# EAGLE design BOSS_FA-1 (EAGLE 7.4.0)
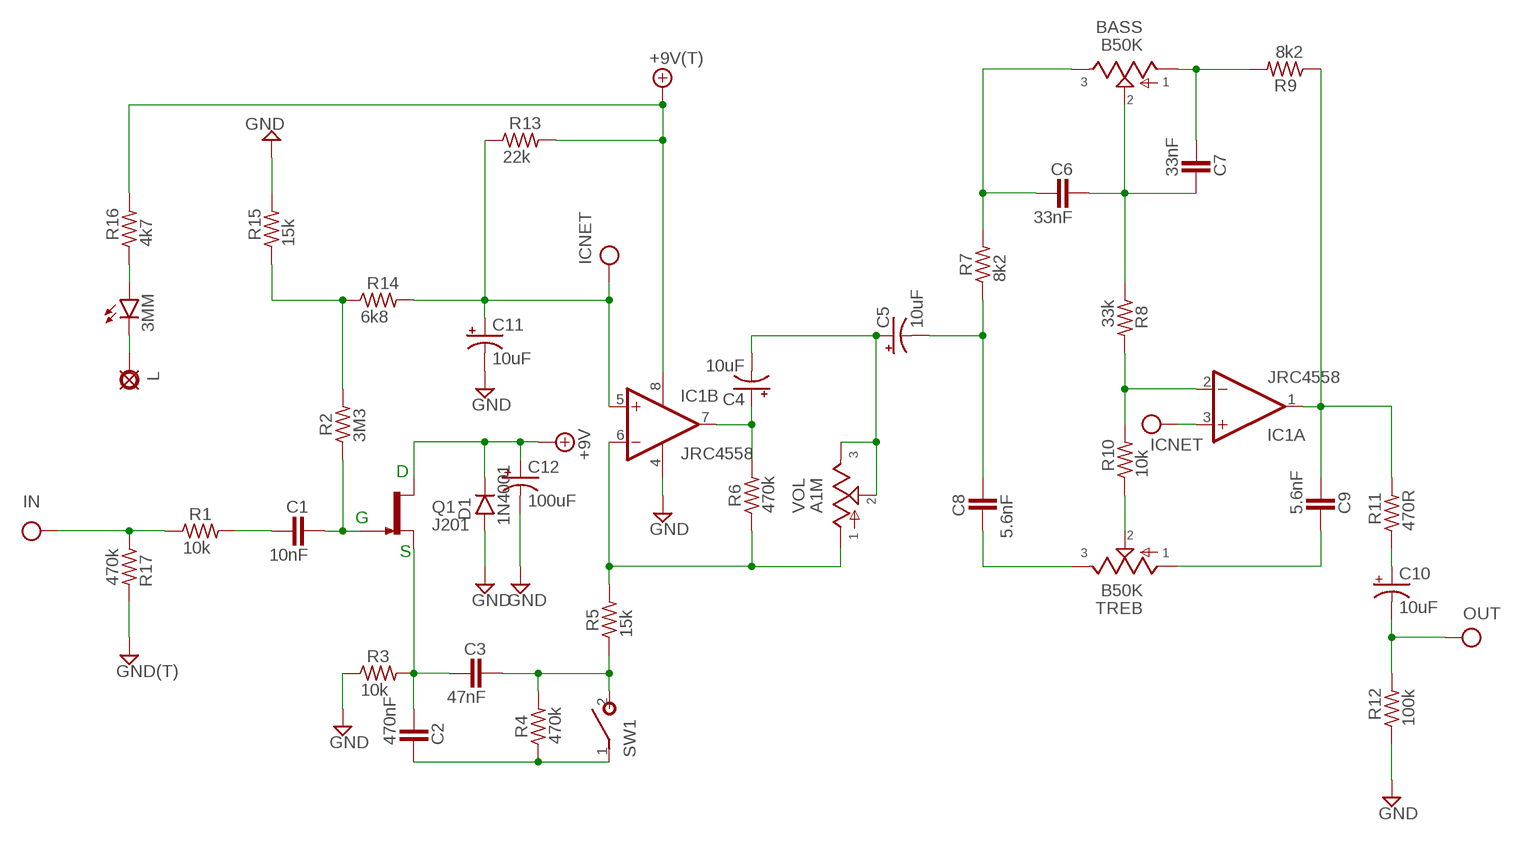
[diagram p0: schematic, sheet 1]

## Parts
3MM  LED3MM  [LED3MM]
+9V  +9V(T)  [SQUARE]
BASS  B50K  POT16MM_PCB_PADS  [16MM_PCB_PADS]
C1  10nF  072X0252  [072X025]
C2  470nF  072X0352  [072X035]
C3  47nF  072X0252  [072X025]
C4  10uF  0501  [050_020_1]
C5  10uF  0501  [050_020_1]
C6  33nF  072X0252  [072X025]
C7  33nF  072X0252  [072X025]
C8  5.6nF  072X0252  [072X025]
C9  5.6nF  072X0252  [072X025]
C10  10uF  0501  [050_020_1]
C11  10uF  0501  [050_020_1]
C12  100uF  0631  [063_025]
D1  1N4001  1N400X.3  [DO41-3]
G  GND(T)  [SQUARE]
IC1  JRC4558  LM4558N  [DIL08]
IN  IN(T)  [SQUARE]
L  PAD  [SQUARE]
OUT  OUT(T)  [SQUARE]
Q1  J201  [TO92-]
R1  10k  6MM.3  [R0207/3]
R2  3M3  6MM.3  [R0207/3]
R3  10k  6MM.3  [R0207/3]
R4  470k  6MM.3  [R0207/3]
R5  15k  6MM.3  [R0207/3]
R6  470k  6MM.3  [R0207/3]
R7  8k2  6MM.3  [R0207/3]
R8  33k  6MM.3  [R0207/3]
R9  8k2  6MM.3  [R0207/3]
R10  10k  6MM.3  [R0207/3]
R11  470R  6MM.3  [R0207/3]
R12  100k  6MM.3  [R0207/3]
R13  22k  6MM.3  [R0207/3]
R14  6k8  6MM.3  [R0207/3]
R15  15k  6MM.3  [R0207/3]
R16  4k7  6MM.3  [R0207/3]
R17  470k  6MM.3  [R0207/3]
SW1  SPST  [SPST]
TREB  B50K  POT16MM_PCB_PADS  [16MM_PCB_PADS]
VOL  A1M  POT16MM_PCB_PADS  [16MM_PCB_PADS]

## Nets
+9V: +9V.1(+9V) C12.+ D1.C IC1.8(P:V+) Q1.3(D) R13.2 R16.2
A: C11.+ IC1.3(A:+IN) IC1.5(B:+IN) R13.1 R14.2 ; supply symbol labelled ICNET
GND: C11.- C12.- D1.A G.1(GND) IC1.4(P:V-) R3.1 R12.1 R15.2 R17.2
IN: IN.1(IN) R1.1 R17.1
N$1: C1.1 R1.2
N$2: C1.2 Q1.1(G) R2.1
N$3: 3MM.A R16.1
N$4: R10.1 TREB.2
N$5: C3.2 R4.2 R5.1 SW1.2(S)
N$6: C4.+ IC1.7(B:OUT) R6.2
N$7: IC1.6(B:-IN) R5.2 R6.1 VOL.1
N$8: 3MM.K(C) L.1(PAD)
N$9: C2.2 R4.1 SW1.1(P)
N$10: C2.1 C3.1 Q1.2(S) R3.2
N$11: C4.- C5.+ VOL.2 VOL.3
N$12: C5.- C8.2 R7.1
N$13: BASS.3 C6.1 R7.2
N$14: BASS.2 C6.2 C7.2 R8.1
N$15: BASS.1 C7.1 R9.2
N$16: C9.1 IC1.1(A:OUT) R9.1 R11.2
N$17: IC1.2(A:-IN) R8.2 R10.2
N$18: C9.2 TREB.1
N$19: C8.1 TREB.3
N$20: C10.+ R11.1
N$21: R2.2 R14.1 R15.1
OUT: C10.- OUT.1(OUT) R12.2

## Notes on the sheet
- D
- G
- S

## Library data of the parts
3MM = mb_diodes:LED
+9V = mb_supply:+9V(T): +9V Voltage Supply use this to hook up +9v throughout a schematic instead of running wire automatically labels the net "+9v" adds a hookup pad to the circuit board
BASS TREB VOL = mb_pots:POT: Potentiometers the arrow indicates the clockwise motion of th wiper (lug 2) fully counter clockwise there is no resistance between lugs 1 and 2 fully clockwise the resistance between lugs 1 and 2 is the value of the pot
C1 C3 C6-C9 = mb_caps-box:072X025: 1000pF - 0.47uF WIMA MKP2 63, 100V: 1000pF - 0.015uF; MKS2 50V: 0.33 - 0.47uF; 63V: 1000pF - 0.22uF;
C2 = mb_caps-box:072X035: 0.15 - 1.0uF; WIMA MKP2 63, 100V: 0.047uF; MKS2 50V: 0.68 - 1.0uF; 63V: 0.33 - 0.47uF; 100V: 0.15 - 0.22uF;
C4 C5 C10 C11 = mb_caps-electro:050: 0.22 - 100uF Xicon values at Mouser.com: 10V: 10 - 100uF; 16V: 2.2 - 47uF; 25V: 0.47 - 47uF; 50V: 0.22 - 22uF
C12 = mb_caps-electro:063: 33 - 220uF Xicon values at Mouser.com 10V: 220uF; 16V: 100uF; 25V: 100uF; 50V: 33uF
D1 = mb_diodes:1N400X: Rectifier Diodes often used in power supply to prevent damage from reverse polarization
G = mb_supply:GND(T): Ground use this to hook up ground (GND) throughout a schematic instead of running wire automatically labels the net "GND" adds a hookup pad to the circuit board (you can use several)
IC1 = mb_ics:*4558: *4558 Op Amp Infamous for its use in tube screamers. This op amp has many manufacturers, hence the leading "*" in the name. The JRC4558 is a widely used example.
IN = mb_supply:IN(T): Input obsolete: use Pad instead and label net shematic input label with circuit board terminal/pad generally used only once on a schematic (because this device labels the net "IN" in the same way as a voltage supply or ground net)
L = mb_supply:PAD: PAD use this package for pads with any purpose, including input, output, send or return various pad shapes: round, square, octogonal, long, and long offset
OUT = mb_supply:OUT(T): Output obsolete: use Pad instead and label net output label with circuit board terminal/pad usually appears only once on a schematic
Q1 = mb_trans:J201: N-channel JFET
R1-R17 = mb_resistors:6MM: 6mm Resistors Leads spaced 1-6 holes apart for 0.1" perfboard. Suitable for 1/4 watt resistors.
SW1 = mb_switches:SPST

## Board
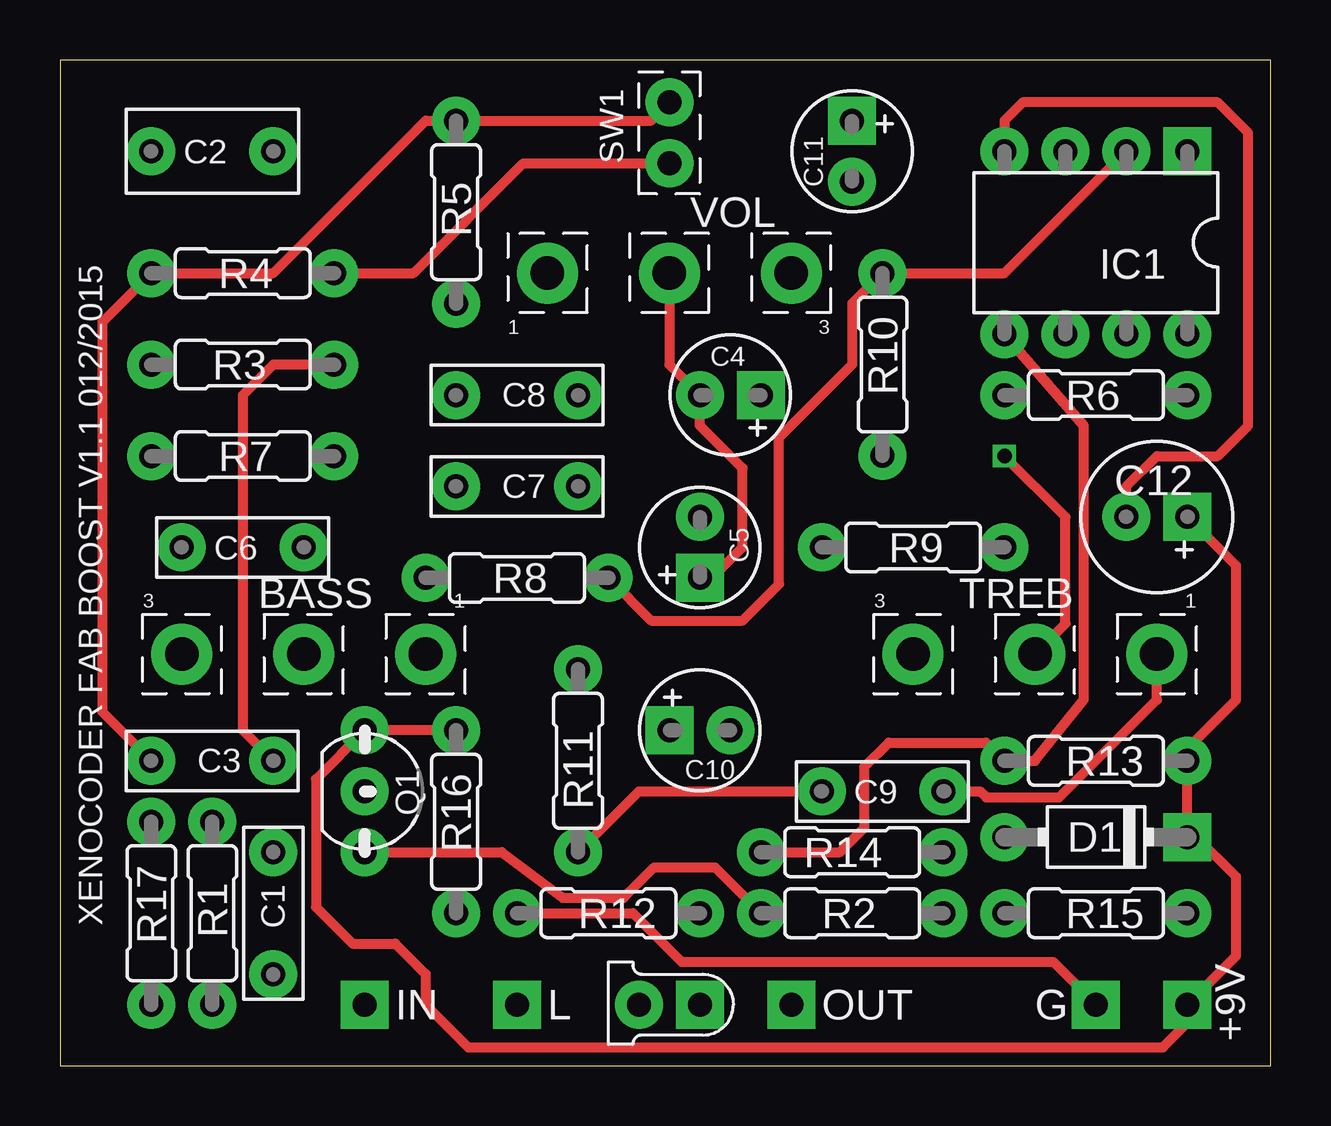
[diagram p1: board, top side]
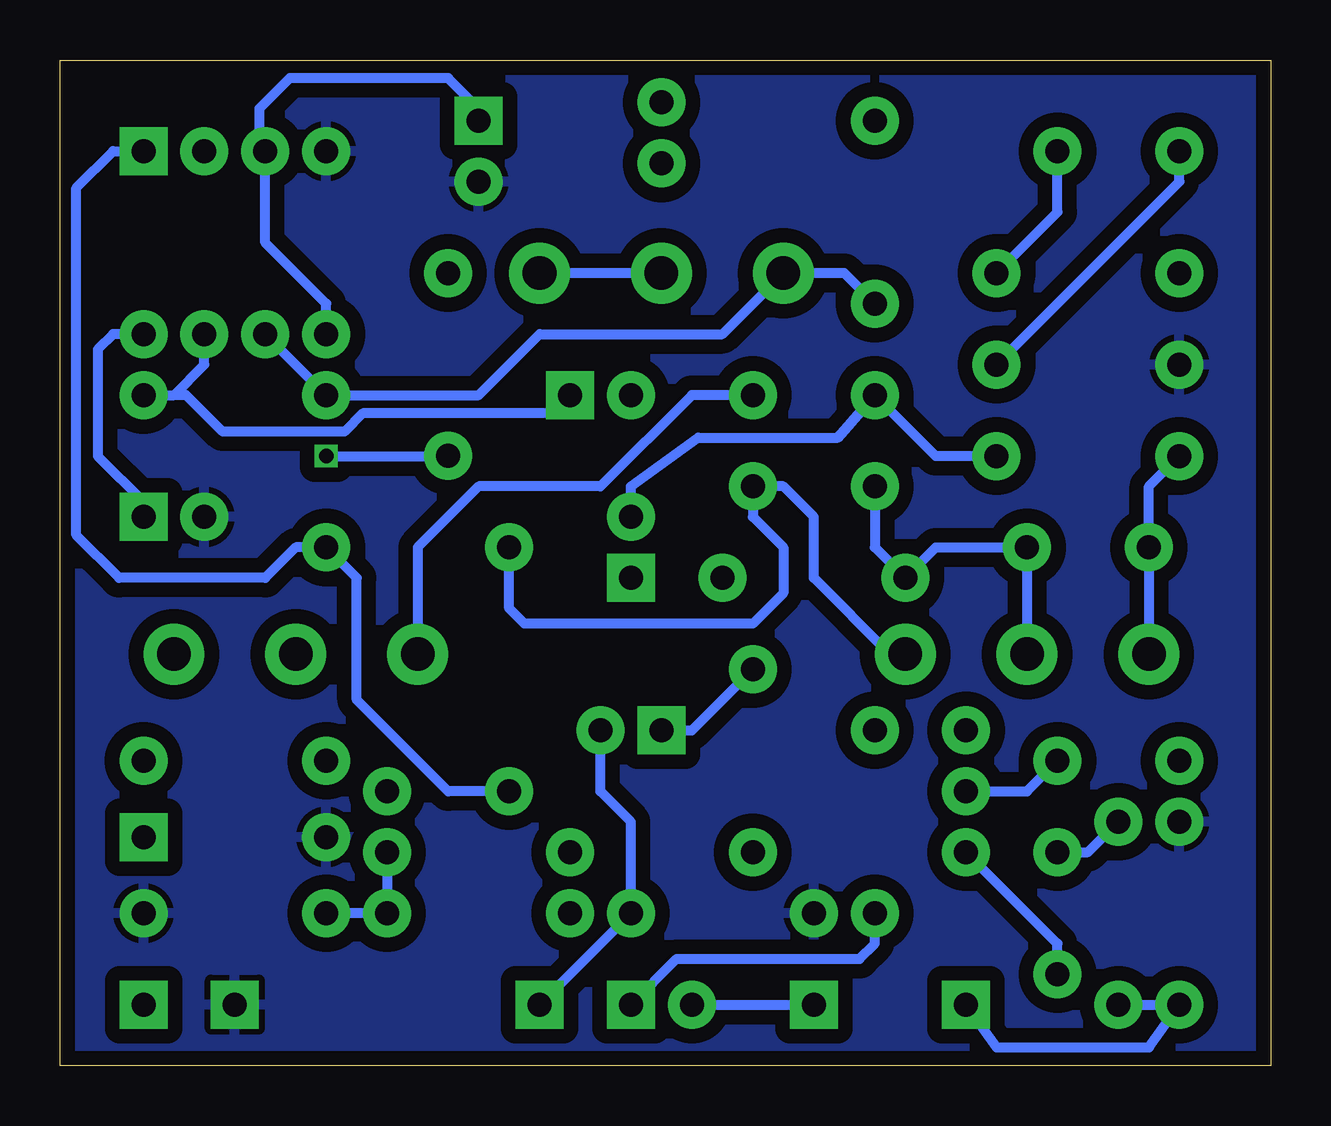
[diagram p2: board, bottom side, seen from below]

Size 50.47 x 41.9 mm. Coordinates in mm from the lower left corner, seen from the top.
Outline: 0,0 50.47,0 50.47,41.9 0,41.9 0,0
Copper layers (1*16): Top 0.0356mm / dielectric 1.5011mm / Bottom 0.0356mm
Design rules "LaenPCBOrder": minimum track width 6mil, minimum drill 13mil, track to track 6mil, track to pad 6mil, pad to pad 6mil, via to via 6mil, smd to smd 6mil, copper to edge 15mil, drill to drill 6mil, minimum pad ring 7mil, minimum via ring 7mil, stop-mask expansion 3mil, vias tented up to drill 0mil, thermal gap 10mil

### Footprints (pad centres in the part's own frame; a part is rotated, then mirrored left to right if it is on the bottom)
LED3MM = drill 1 pad 2 square: A -1.27,0 | drill 1 pad 2: K 1.27,0
SQUARE = drill 1 pad 2 square: 1 0,0
16MM_PCB_PADS = drill 1.4 pad 2.54: 1 5.08,0; 2 0,0; 3 -5.08,0
072X025 = drill 1 pad 2: 1 -2.54,0; 2 2.54,0
072X035 = drill 1 pad 2: 1 -2.54,0; 2 2.54,0
050_020_1 = drill 1 pad 2 square: + -1.27,0 | drill 1 pad 2: - 1.27,0
063_025 = drill 1 pad 2 square: + -1.27,0 | drill 1 pad 2: - 1.27,0
DO41-3 = drill 1 pad 2: A 3.81,0 | drill 1 pad 2 square: C -3.81,0
DIL08 = drill 1 pad 2 square: 1 -3.81,-3.81 | drill 1 pad 2: 2 -1.27,-3.81; 3 1.27,-3.81; 4 3.81,-3.81; 5 3.81,3.81; 6 1.27,3.81; 7 -1.27,3.81; 8 -3.81,3.81
TO92- = drill 1 pad 2: 1 2.54,0; 2 0,0; 3 -2.54,0
R0207/3 = drill 1 pad 2: 1 -3.81,0; 2 3.81,0
SPST = drill 1 pad 2: 1 -1.27,0; 2 1.27,0

### Placement (x,y rotation side)
3MM  25.4,2.54 180 top
+9V  46.99,2.54 0 top
BASS  10.16,17.14 0 top
C1  8.89,6.35 270 top
C2  6.35,38.1 0 top
C3  6.35,12.7 180 top
C4  27.94,27.94 180 top
C5  26.67,21.59 90 top
C6  7.62,21.59 0 top
C7  19.05,24.13 180 top
C8  19.05,27.94 180 top
C9  34.29,11.43 0 top
C10  26.67,13.97 0 top
C11  33.02,38.1 270 top
C12  45.72,22.86 180 top
D1  43.18,9.53 180 top
G  43.18,2.54 0 top
IC1  43.18,34.29 180 top
IN  12.7,2.54 0 top
L  19.05,2.54 0 top
OUT  30.48,2.54 0 top
Q1  12.7,11.43 270 top
R1  6.35,6.35 90 top
R2  33.02,6.35 0 top
R3  7.62,29.21 0 top
R4  7.62,33.02 180 top
R5  16.51,35.56 270 top
R6  43.18,27.94 0 top
R7  7.62,25.4 180 top
R8  19.05,20.32 0 top
R9  35.56,21.59 180 top
R10  34.29,29.21 90 top
R11  21.59,12.7 270 top
R12  22.86,6.35 0 top
R13  43.18,12.7 0 top
R14  33.02,8.89 180 top
R15  43.18,6.35 0 top
R16  16.51,10.16 90 top
R17  3.81,6.35 90 top
SW1  25.4,38.86 90 top
TREB  40.64,17.14 0 top
VOL  25.4,33.02 180 top

### Tracks (layer width: path | path; a pad name or v marks a point on that pad's centre or on a via)
+9V
  Top 0.406: C12.+ 49.02,20.83 49.02,15.24 46.99,13.21 R13.2 D1.C 47.37,9.53 49.02,7.87 49.02,4.57 +9V.1 46.99,1.78 45.97,0.76 17.02,0.76 15.24,2.54 15.24,3.81 13.97,5.08 12.19,5.08 10.67,6.6 10.67,11.94 Q1.3 R16.2
  Bottom 0.406: IC1.8 48.26,30.48 48.9,29.84 48.9,25.4 46.99,23.5 C12.+
A
  Top 0.406: IC1.5 42.67,26.67 42.67,15.24 40.64,12.7 R13.1 38.61,13.46 34.54,13.46 33.53,12.45 33.53,9.91 32.51,8.89 R14.2
  Bottom 0.406: C11.+ 33.02,39.88 34.29,41.15 40.89,41.15 42.16,39.88 42.16,38.35 IC1.3 41.91,34.29 39.37,31.75 IC1.5
GND
  Top 0.406: R12.1 23.88,6.35 25.91,4.32 41.4,4.32 G.1 | C12.- 44.45,24.13 45.72,25.4 48.26,25.4 49.53,26.67 49.53,38.86 48.26,40.13 40.13,40.13 39.37,39.37 IC1.4
  pour Bottom (isolate 0.61): 0,41.91 50.8,41.91 50.8,0 0,0
IN
  Bottom 0.406: IN.1 11.43,0.76 5.08,0.76 R17.1 R1.1
N$1
  Bottom 0.406: C1.1 7.62,8.89 R1.2
N$2
  Top 0.406: Q1.1 18.41,8.89 20.95,6.99 23.5,6.99 24.77,8.26 27.3,8.26 R2.1
  Bottom 0.406: C1.2 8.89,5.08 Q1.1
N$3
  Bottom 0.406: 3MM.A 24.77,4.45 17.14,4.45 16.51,5.08 R16.1
N$4  (via drill 0.6)
  Top 0.406: TREB.2 41.91,18.41 41.91,22.86 v39.37,25.4
  Bottom 0.406: v39.37,25.4 R10.1
N$5
  Top 0.406: C3.2 1.78,14.73 1.78,30.99 R4.2 8.89,33.02 15.24,39.37 R5.1 24.64,39.37 SW1.2
N$6
  Bottom 0.406: R6.2 45.72,27.94 | 45.72,27.94 44.45,29.21 IC1.7 | C4.+ 29.97,27.18 37.85,27.18 38.61,26.42 43.69,26.42 45.21,27.94 45.72,27.94
N$7
  Bottom 0.406: IC1.6 R6.1 33.02,27.94 30.48,30.48 22.86,30.48 VOL.1 17.78,33.02 R5.2
N$8
  Bottom 0.406: 3MM.K L.1
N$9
  Top 0.406: R4.1 14.73,33.02 19.3,37.59 SW1.1
  Bottom 0.406: R4.1 8.89,35.56 C2.2
N$10
  Top 0.406: R3.2 8.89,29.21 7.62,27.94 7.62,13.97 C3.1
  Bottom 0.406: R3.2 3.81,36.83 C2.1 | Q1.2 10.16,11.43 C3.1
N$11
  Top 0.406: VOL.2 25.4,29.21 C4.- 26.67,26.67 28.45,24.89 28.45,21.59 27.18,20.32 C5.+
  Bottom 0.406: VOL.2 VOL.3
N$12
  Bottom 0.406: R7.1 13.97,25.4 C8.2 18.03,26.16 23.88,26.16 26.67,24.13 C5.-
N$13
  Bottom 0.406: BASS.3 C6.1 5.08,24.13 R7.2
N$14
  Bottom 0.406: BASS.2 C6.2 13.97,21.59 R8.1 16.51,21.59 C7.2
N$15
  Bottom 0.406: BASS.1 15.88,17.14 19.05,20.32 19.05,22.86 20.32,24.13 C7.1 21.59,22.86 20.32,21.59 20.32,19.68 21.59,18.41 31.11,18.41 31.75,19.05 R9.2
N$16
  Top 0.406: R11.2 24.13,11.43 C9.1
  Bottom 0.406: C9.1 34.29,11.43 38.1,15.24 38.1,20.32 R9.1 40.64,21.59 41.91,20.32 48.01,20.32 49.78,22.1 49.78,36.58 48.26,38.1 IC1.1
N$17
  Top 0.406: IC1.2 39.37,33.02 R10.2 33.02,31.75 33.02,29.21 29.97,26.16 29.97,20.07 28.45,18.54 24.64,18.54 R8.2
N$18
  Top 0.406: C9.2 38.35,11.43 38.61,11.18 41.66,11.18 45.72,15.24 TREB.1
N$19
  Bottom 0.406: C8.1 24.13,27.94 27.94,24.13 33.02,24.13 35.56,21.59 TREB.3
N$20
  Bottom 0.406: C10.+ 24.13,13.97 R11.1
N$21
  Bottom 0.406: R14.1 R2.2 R15.1
OUT
  Bottom 0.406: OUT.1 R12.2 26.67,10.16 27.94,11.43 C10.-

### Text on the board
tNames: XENOCODER FAB BOOST V1.1 012/2015